# Altium schematic sheet power_breakout.SchDoc
size A4; SheetNumber: 4; SheetTotal: 4
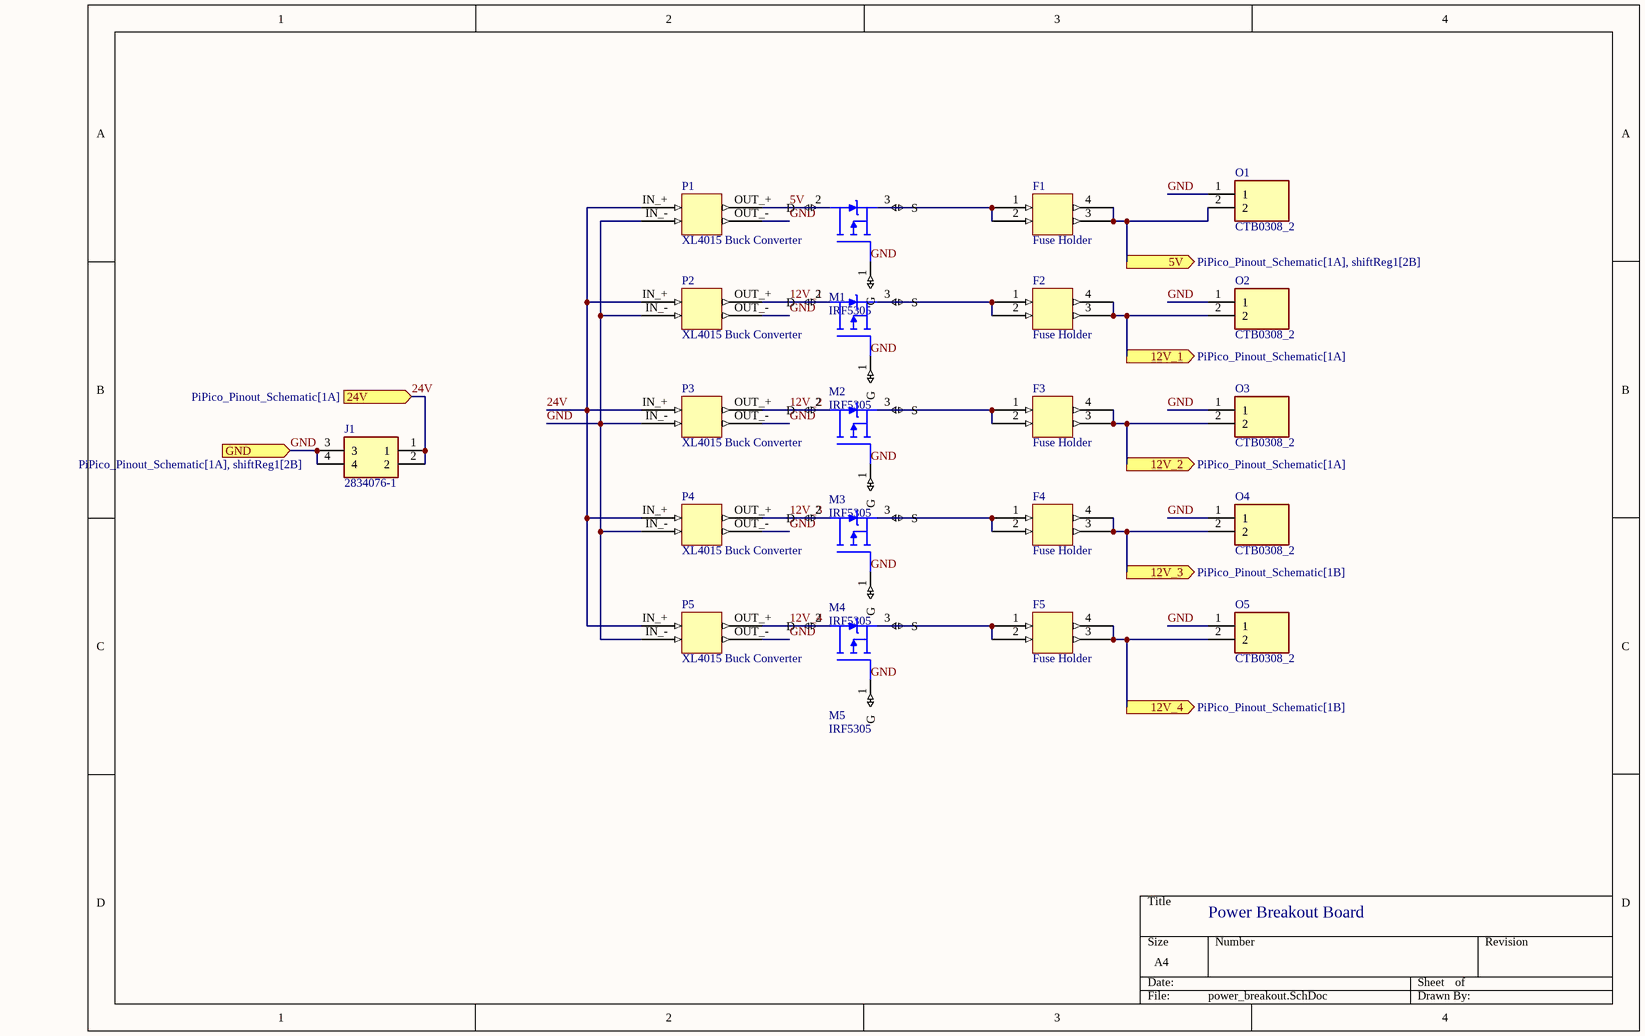
[diagram p0: power_breakout.SchDoc]

## Parts
F1  Fuse Holder  [Fuse Holder]
F2  Fuse Holder  [Fuse Holder]
F3  Fuse Holder  [Fuse Holder]
F4  Fuse Holder  [Fuse Holder]
F5  Fuse Holder  [Fuse Holder]
J1  2834076-1  [28340761]
M1  IRF5305  [TO254P1041X444X1930-3]
M2  IRF5305  [TO254P1041X444X1930-3]
M3  IRF5305  [TO254P1041X444X1930-3]
M4  IRF5305  [TO254P1041X444X1930-3]
M5  IRF5305  [TO254P1041X444X1930-3]
O1  CTB0308_2  [CTB03082]
O2  CTB0308_2  [CTB03082]
O3  CTB0308_2  [CTB03082]
O4  CTB0308_2  [CTB03082]
O5  CTB0308_2  [CTB03082]
P1  XL4015 Buck Converter  [XL4015 Buck Converter]
P2  XL4015 Buck Converter  [XL4015 Buck Converter]
P3  XL4015 Buck Converter  [XL4015 Buck Converter]
P4  XL4015 Buck Converter  [XL4015 Buck Converter]
P5  XL4015 Buck Converter  [XL4015 Buck Converter]

## Ports
5V (out, see PiPico_Pinout_Schematic[1A], shiftReg1[2B]), 12V_1 (out, see PiPico_Pinout_Schematic[1A]), 12V_2 (out, see PiPico_Pinout_Schematic[1A]), 12V_3 (out, see PiPico_Pinout_Schematic[1B]), 12V_4 (out, see PiPico_Pinout_Schematic[1B]), 24V (in, see PiPico_Pinout_Schematic[1A]), GND (in, see PiPico_Pinout_Schematic[1A], shiftReg1[2B])

## Nets
5V: M1.2(D) P1.OUT_+
5V: F1.3 F1.4 O1.2 ; port 5V  [a separate net that carries the same name]
12V_1: M2.2(D) P2.OUT_+
12V_1: F2.3 F2.4 O2.2 ; port 12V_1  [a separate net that carries the same name]
12V_2: M3.2(D) P3.OUT_+
12V_2: F3.3 F3.4 O3.2 ; port 12V_2  [a separate net that carries the same name]
12V_3: M4.2(D) P4.OUT_+
12V_3: F4.3 F4.4 O4.2 ; port 12V_3  [a separate net that carries the same name]
12V_4: M5.2(D) P5.OUT_+
12V_4: F5.3 F5.4 O5.2 ; port 12V_4  [a separate net that carries the same name]
24V: J1.1 J1.2 P1.IN_+ P2.IN_+ P3.IN_+ P4.IN_+ P5.IN_+ ; port 24V
GND: J1.3 J1.4 M1.1(G) M2.1(G) M3.1(G) M4.1(G) M5.1(G) O1.1 O2.1 O3.1 O4.1 O5.1 P1.IN_- P1.OUT_- P2.IN_- P2.OUT_- P3.IN_- P3.OUT_- P4.IN_- P4.OUT_- P5.IN_- P5.OUT_- ; port GND
NetF1_1: F1.1 F1.2 M1.3(S)
NetF2_1: F2.1 F2.2 M2.3(S)
NetF3_1: F3.1 F3.2 M3.3(S)
NetF4_1: F4.1 F4.2 M4.3(S)
NetF5_1: F5.1 F5.2 M5.3(S)

## Notes on the sheet
- Power Breakout Board

## Library data of the parts
J1 = 2834076-1: Connector; Manufacturer_Name: TE Connectivity; Datasheet Link: https://www.te.com/commerce/DocumentDelivery/DDEController?Action=srchrtrv&DocNm=1-1773930-3_BuchananWM_Brochure&DocType=Data%20Sheet&DocLang=English&PartCntxt=2834076-1&DocFormat=pdf; Height: 13.2mm; Manufacturer_Part_Number: 2834076-1; Mouser Part Number: 571-2834076-1; Mouser Price/Stock: https://www.mouser.co.uk/ProductDetail/TE-Connectivity/2834076-1?qs=Ok18xCFj7mt8Xwdyj7IaIQ%3D%3D; Arrow Part Number: 2834076-1; Arrow Price/Stock: https://www.arrow.com/en/products/2834076-1/te-connectivity
M1-M5 = IRF5305: P-Channel 55 V 31A (Tc) 3.8W (Ta), 110W (Tc) Surface Mount D2PAK; MF: Infineon Technologies; Package: TO-220 Infineon; Price: None; Value: *; SnapEDA_Link: https://www.snapeda.com/parts/IRF5305/Infineon+Technologies/view-part/?ref=snap; MP: IRF5305; Availability: In Stock; Check_prices: https://www.snapeda.com/parts/IRF5305/Infineon+Technologies/view-part/?ref=eda
O1-O5 = CTB0308_2: Connector; Manufacturer_Name: CAMDENBOSS; Manufacturer_Part_Number: CTB0308/2; Datasheet Link: https://www.farnell.com/datasheets/2340633.pdf; Height: 9.1mm